# Altium schematic sheet Mezz_Board.SchDoc
size A2; Date: Date; CompanyName: HESSO; Engineer: Name; Address1: Route du Rawyl 47; Address2: 1950 Sion; Address3: Switzerland; DocumentNumber: 8; SheetNumber: 8; SheetTotal: 8; ProjectName: Project Name
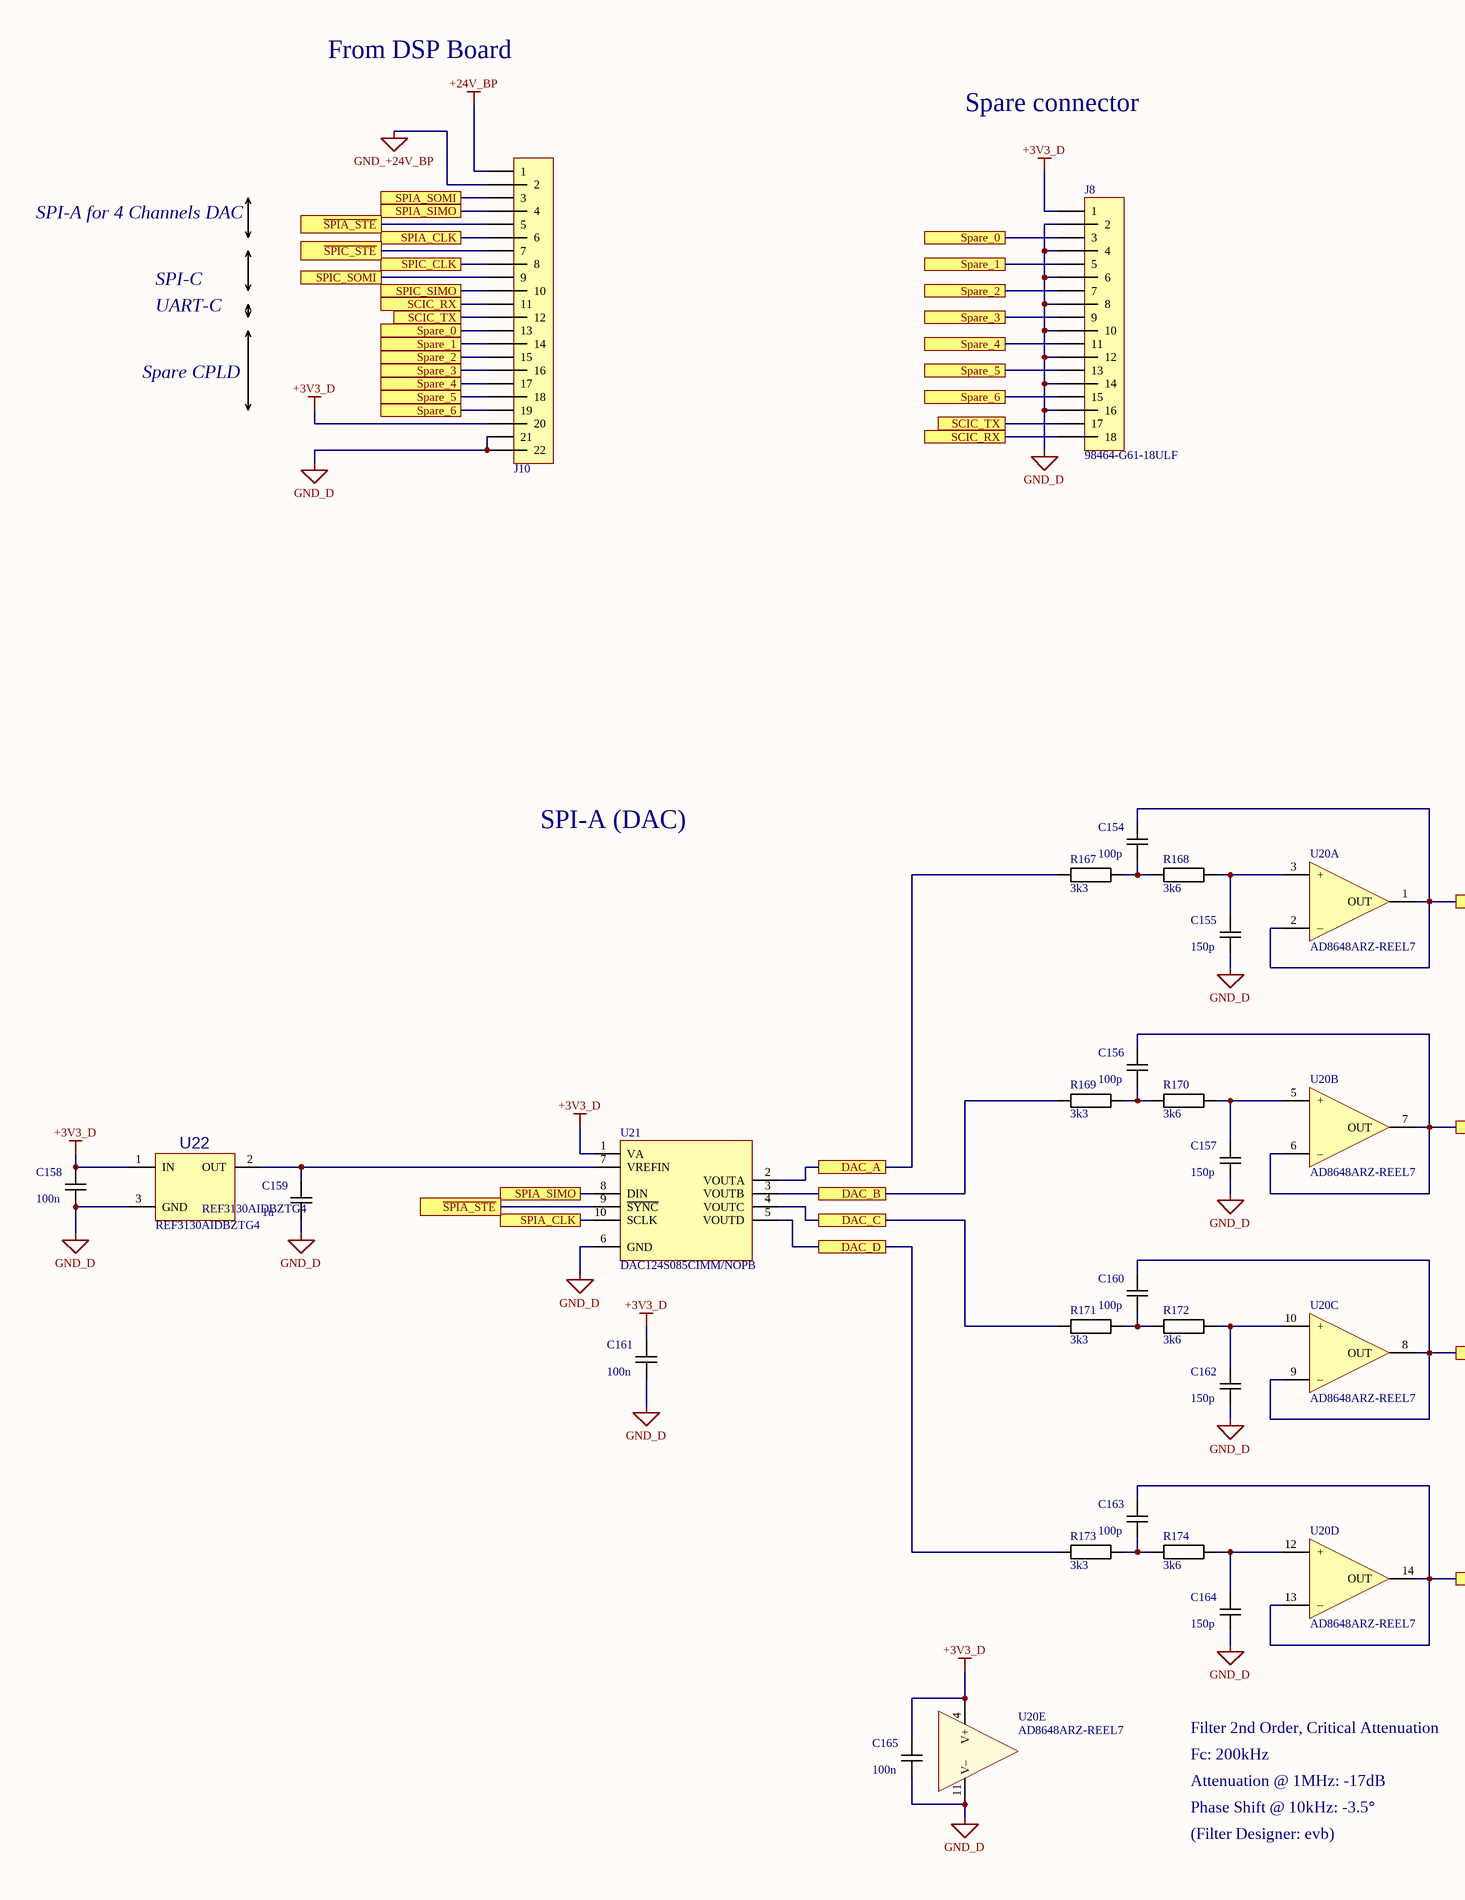
[diagram p0: Mezz_Board.SchDoc, left]
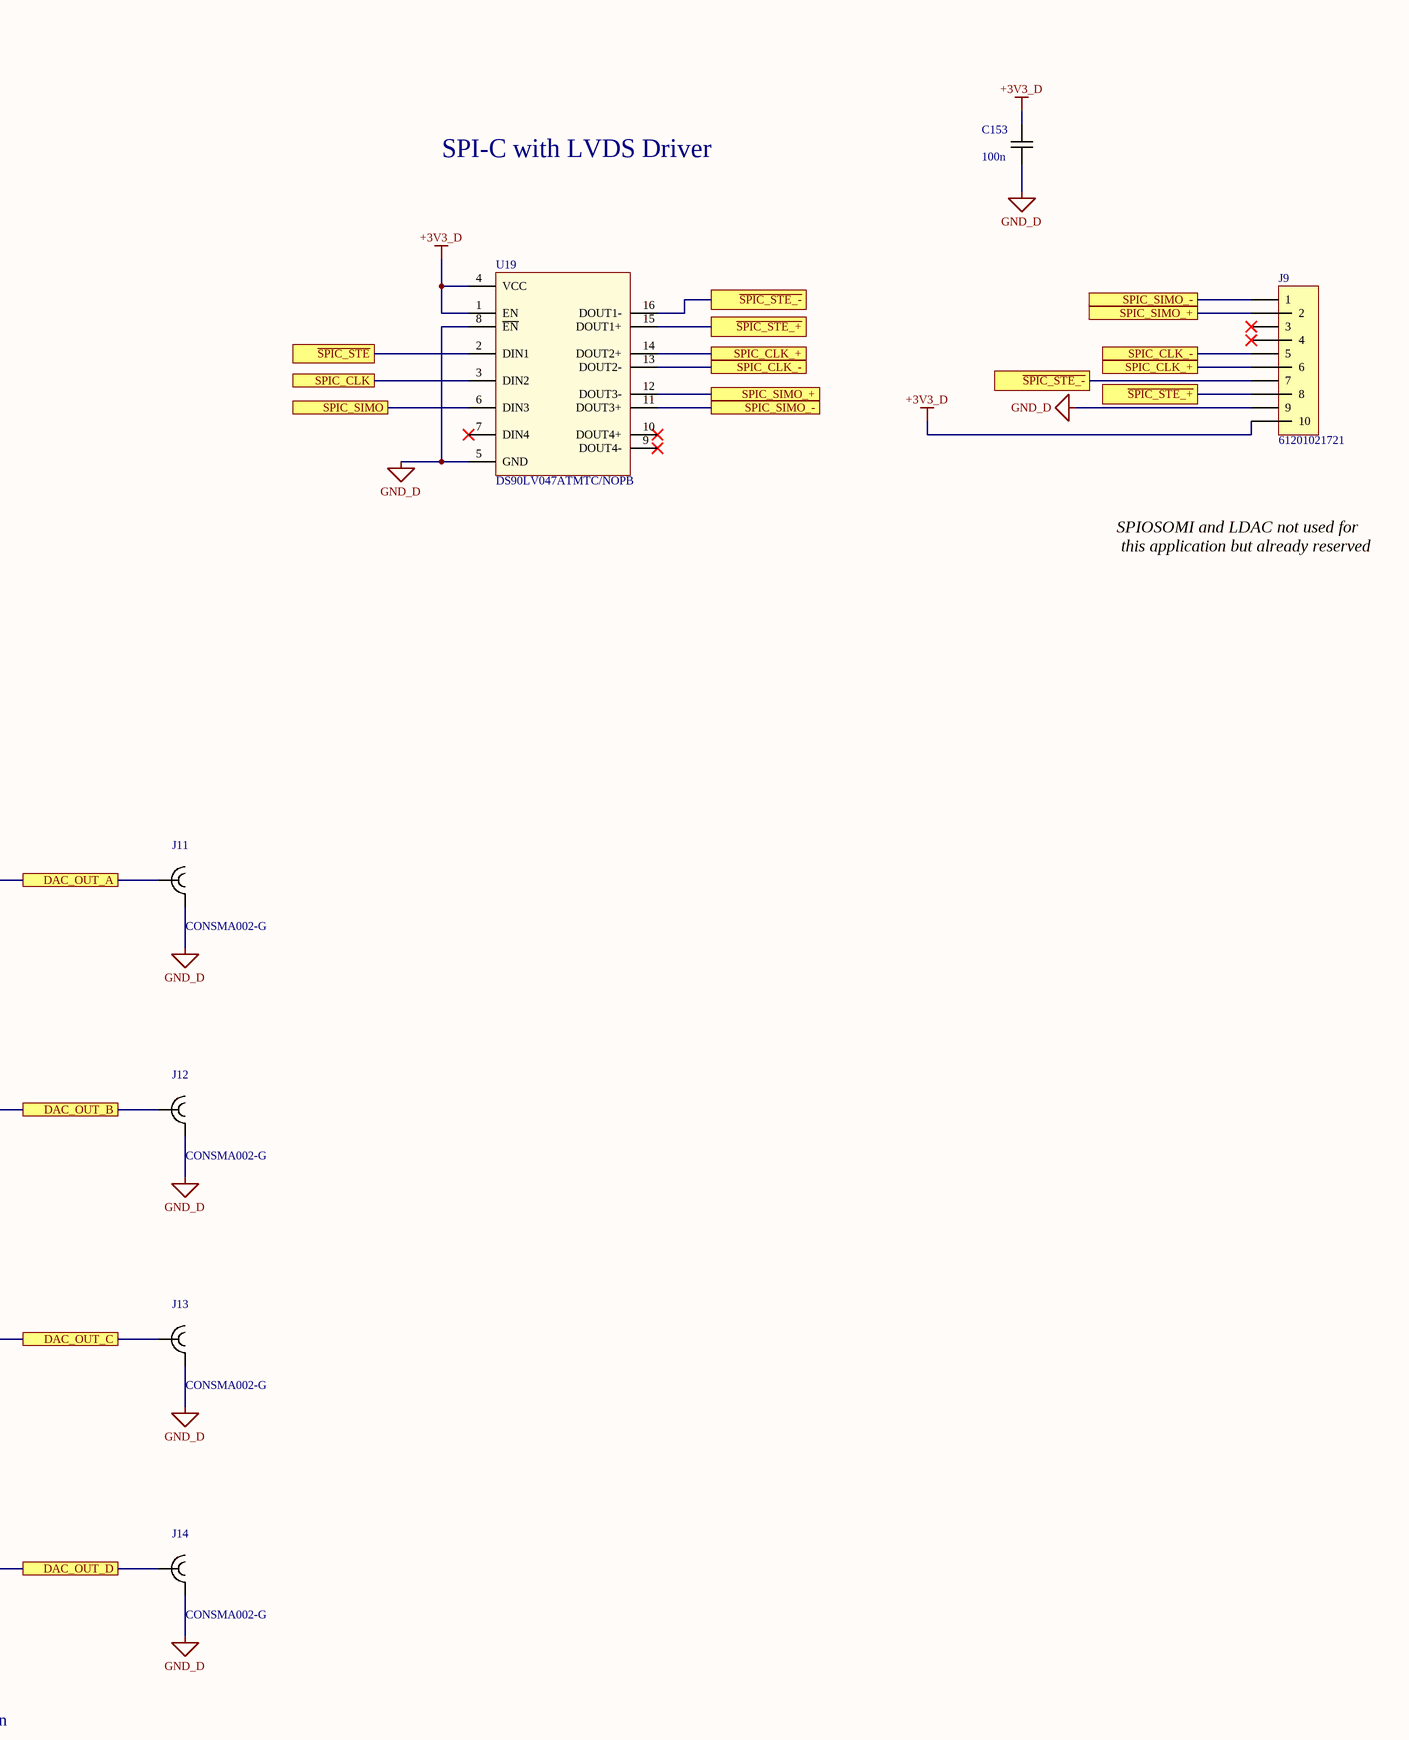
[diagram p1: Mezz_Board.SchDoc, right]

## Parts
C153  100n  [CAPACITOR 2012 REFLOW]
C154  100p  [CAPACITOR 2012 REFLOW]
C155  150p  [CAPACITOR 2012 REFLOW]
C156  100p  [CAPACITOR 2012 REFLOW]
C157  150p  [CAPACITOR 2012 REFLOW]
C158  100n  [CAPACITOR 2012 REFLOW]
C159  1u  [CAPACITOR 2012 REFLOW]
C160  100p  [CAPACITOR 2012 REFLOW]
C161  100n  [CAPACITOR 1608 REFLOW]
C162  150p  [CAPACITOR 2012 REFLOW]
C163  100p  [CAPACITOR 2012 REFLOW]
C164  150p  [CAPACITOR 2012 REFLOW]
C165  100n  [CAPACITOR 1608 REFLOW]
J8  98464-G61-18ULF  [FlatCable2x9 2MM Right Angle TH FCI 98614-G61-18ULF]
J9  61201021721  [FlatCable2x5 2.54MM RIGHT ANGLE TH]
J10  *  [PinHeader2x11 P2.54 A]  (value not drawn)
J11  CONSMA002-G  [SMA TH Right Angle Linx CONSMA002]
J12  CONSMA002-G  [SMA TH Right Angle Linx CONSMA002]
J13  CONSMA002-G  [SMA TH Right Angle Linx CONSMA002]
J14  CONSMA002-G  [SMA TH Right Angle Linx CONSMA002]
R167  3k3  [RESISTOR 2012 REFLOW]
R168  3k6  [RESISTOR 2012 REFLOW]
R169  3k3  [RESISTOR 2012 REFLOW]
R170  3k6  [RESISTOR 2012 REFLOW]
R171  3k3  [RESISTOR 2012 REFLOW]
R172  3k6  [RESISTOR 2012 REFLOW]
R173  3k3  [RESISTOR 2012 REFLOW]
R174  3k6  [RESISTOR 2012 REFLOW]
U19  DS90LV047ATMTC/NOPB  [TSSOP16 P0.65 C5.0x4.5 H1.1]
U20  AD8648ARZ-REEL7  [SO14 P1.27 C4.0X8.8 H1.75]  (parts A,B,C,D,E of 5)
U21  DAC124S085CIMM/NOPB  [VSSOP10 P0.5 C3.1X3.1 H1.1]
U22  REF3130AIDBZTG4  [SOT23 P0.95 C1.6x3.0 H1.3]

## Ports
DAC_A, DAC_B, DAC_C, DAC_D, DAC_OUT_A, DAC_OUT_B, DAC_OUT_C, DAC_OUT_D, SCIC_RX, SCIC_TX, Spare_0, Spare_1, Spare_2, Spare_3, Spare_4, Spare_5, Spare_6, SPIA_CLK, SPIA_SIMO, SPIA_SOMI, SPIC_CLK, SPIC_CLK_+, SPIC_CLK_-, SPIC_SIMO, SPIC_SIMO_+, SPIC_SIMO_-, SPIC_SOMI, ~{SPIA_STE}, ~{SPIC_STE_+}, ~{SPIC_STE_-}, ~{SPIC_STE}

## Nets
+3V3_D: C153.2 C158.2 C161.2 C165.2 J8.1 J9.10 J10.20 U19.1(EN) U19.4(VCC) U20.4(V+) U21.1(VA) U22.1(IN)
+24V_BP: J10.1
GND_+24V_BP: J10.2
GND_D: C153.1 C155.1 C157.1 C158.1 C159.1 C161.1 C162.1 C164.1 C165.1 J8.2 J8.4 J8.6 J8.8 J8.10 J8.12 J8.14 J8.16 J9.9 J10.21 J10.22 J11.2 J12.2 J13.2 J14.2 U19.5(GND) U19.8(~{EN}) U20.11(V–) U21.6(GND) U22.3(GND)
~{SPIA_STE}: J10.5 U21.9(~{SYNC}) ; port ~{SPIA_STE}
~{SPIC_STE}: J10.7 U19.2(DIN1) ; port ~{SPIC_STE}
~{SPIC_STE_+}: J9.8 U19.15(DOUT1+) ; port ~{SPIC_STE_+}
~{SPIC_STE_-}: J9.7 U19.16(DOUT1-) ; port ~{SPIC_STE_-}
DAC_A: R167.1 U21.2(VOUTA) ; port DAC_A
DAC_B: R169.1 U21.3(VOUTB) ; port DAC_B
DAC_C: R171.1 U21.4(VOUTC) ; port DAC_C
DAC_D: R173.1 U21.5(VOUTD) ; port DAC_D
DAC_OUT_A: C154.2 J11.1 U20.1(OUT) U20.2(–) ; port DAC_OUT_A
DAC_OUT_B: C156.2 J12.1 U20.6(–) U20.7(OUT) ; port DAC_OUT_B
DAC_OUT_C: C160.2 J13.1 U20.8(OUT) U20.9(–) ; port DAC_OUT_C
DAC_OUT_D: C163.2 J14.1 U20.13(–) U20.14(OUT) ; port DAC_OUT_D
SCIC_RX: J8.18 J10.11 ; port SCIC_RX
SCIC_TX: J8.17 J10.12 ; port SCIC_TX
Spare_0: J8.3 J10.13 ; port Spare_0
Spare_1: J8.5 J10.14 ; port Spare_1
Spare_2: J8.7 J10.15 ; port Spare_2
Spare_3: J8.9 J10.16 ; port Spare_3
Spare_4: J8.11 J10.17 ; port Spare_4
Spare_5: J8.13 J10.18 ; port Spare_5
Spare_6: J8.15 J10.19 ; port Spare_6
SPIA_CLK: J10.6 U21.10(SCLK) ; port SPIA_CLK
SPIA_SIMO: J10.4 U21.8(DIN) ; port SPIA_SIMO
SPIA_SOMI: J10.3 ; port SPIA_SOMI
SPIC_CLK: J10.8 U19.3(DIN2) ; port SPIC_CLK
SPIC_CLK_+: J9.6 U19.14(DOUT2+) ; port SPIC_CLK_+
SPIC_CLK_-: J9.5 U19.13(DOUT2-) ; port SPIC_CLK_-
SPIC_SIMO: J10.10 U19.6(DIN3) ; port SPIC_SIMO
SPIC_SIMO_+: J9.2 U19.12(DOUT3-) ; port SPIC_SIMO_+
SPIC_SIMO_-: J9.1 U19.11(DOUT3+) ; port SPIC_SIMO_-
SPIC_SOMI: J10.9 ; port SPIC_SOMI
NetC154_1: C154.1 R167.2 R168.1
NetC155_2: C155.2 R168.2 U20.3(+)
NetC156_1: C156.1 R169.2 R170.1
NetC157_2: C157.2 R170.2 U20.5(+)
NetC159_2: C159.2 U21.7(VREFIN) U22.2(OUT)
NetC160_1: C160.1 R171.2 R172.1
NetC162_2: C162.2 R172.2 U20.10(+)
NetC163_1: C163.1 R173.2 R174.1
NetC164_2: C164.2 R174.2 U20.12(+)

Not connected (* = marked no-connect by the designer): J9 3* 4*; U19 7(DIN4)* 9(DOUT4-)* 10(DOUT4+)*

## Notes on the sheet
- From DSP Board
- Spare connector
- SPI-A for 4 Channels DAC
- SPI-C with LVDS Driver
- SPI-C
- UART-C
- Spare CPLD
- SPIOSOMI and LDAC not used for
  this application but already reserved
- SPI-A (DAC)
- Filter 2nd Order, Critical Attenuation
- Fc: 200kHz
- Attenuation @ 1MHz: -17dB
- Phase Shift @ 10kHz: -3.5°
- (Filter Designer: evb)
- Date :
- Revision :
- Sheet
- of
- Design by :

## Library data of the parts
C153-C158 C160 C162-C164 = Capacitor: Capacitor X7R 10% 50V 2012(0805)
  C153 C158: Value: 100n
  C154 C156 C160 C163: Value: 100p
  C155 C157 C162 C164: Value: 150p
C159 = Capacitor: Capacitor X7R 10% 10V 2012(0805); Value: 1u
C161 C165 = Capacitor: Capacitor X7R 10% 50V 1608(0603); Value: 100n
J8 = FlatCable2x9: Manufacturer: Amphenol FCI; Mouser No.: 649-98464-G61-18ULF; Value: 98464-G61-18ULF
J9 = FlatCable2x5: Manufacturer: Wurth Elektronik; Mouser No.: 710-61201021721; Value: 61201021721
J10 = PinHeader2x11: Plug connector; Value: *
J11-J14 = SMA TH RIGHT ANGLE LINX CONSMA002: Manufacturer: Linx Technologies; Value: CONSMA002-G; Mouser No.: 712-CONSMA002-G
R167-R174 = Resistor: Resistor 1% 50V 125mW 2012(0805)
  R167 R169 R171 R173: Value: 3k3
  R168 R170 R172 R174: Value: 3k6
U19 = DS90LV047A: DS90LV047A 3-V LVDS Quad CMOS Differential Line Driver; Manufacturer: Texas Instruments; Value: DS90LV047ATMTC/NOPB; Mouser No.: 926-DS90LV047ATMTCNO
U20 = OPA QUAD: Generic quad OPA 14 pins; Manufacturer: Analog Devices; Value: AD8648ARZ-REEL7; Mouser No.: 584-AD8648ARZ-R7
U21 = DAC124S085CIMM: DAC124S085 12-Bit Micro Power Quad Digital-to-Analog Converter With Rail-to-Rail Output; Manufacturer: Texas Instruments; Value: DAC124S085CIMM/NOPB; Mouser No.: 926-DAC124S085CIMMNO
U22 = REFERENCE SOT23 IN-OUT- GND: Generic Positive Voltage Reference; Manufacturer: Texas Instruments; Value: REF3130AIDBZTG4; Mouser No.: 595-REF3130AIDBZTG4